# Altium schematic sheet PowerDistribution.SchDoc
size A
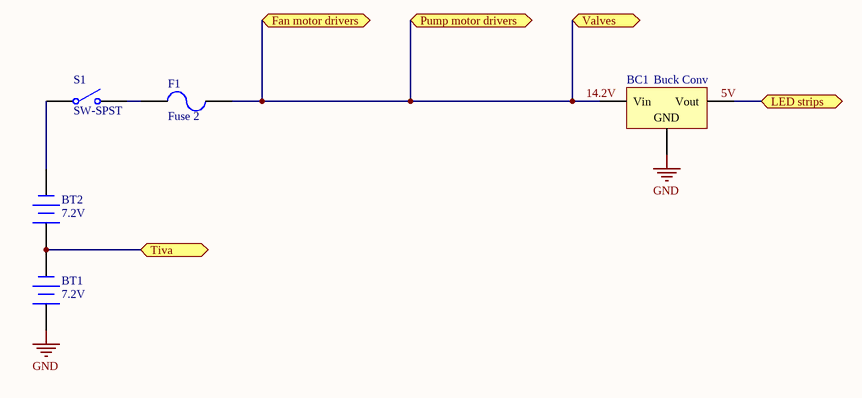
[diagram p0: PowerDistribution.SchDoc]

## Parts
BC1  Buck Conv  [D2PAK_L]
BT1  7.2V  [BAT-2]
BT2  7.2V  [BAT-2]
F1  Fuse 2  [PIN-W2/E2.8]
S1  SW-SPST  [SPST-2]

## Ports
Fan motor drivers (bidir), LED strips (bidir), Pump motor drivers (bidir), Tiva (bidir), Valves (bidir)

## Nets
GND: BC1.2(GND) BT1.1(+)
14.2V: BC1.1(Vin) F1.1 ; port Fan motor drivers, port Pump motor drivers, port Valves
LED strips: BC1.3(Vout) ; port LED strips
Tiva: BT1.2(-) BT2.1(+) ; port Tiva
NetBT2_2: BT2.2(-) S1.1(COMMON)
NetF1_2: F1.2 S1.2(NO)

## Notes on the sheet
- Labels drawn without touching a wire or pin: 5V

## Library data of the parts
BC1 = Volt Reg: Voltage Regulator; Published: 24-Mar-1999; LatestRevisionDate: 29-May-2009; LatestRevisionNote: IPC-7351 Footprint Added.; PackageReference: D2PAK; Publisher: Altium Limited; PackageDescription: 3-Pin Transistor Outline Package 2.54 mm Pitch, 15.1 mm Lead Span
BT1 BT2 = Battery: Multicell Battery; Manufacturer: Generic Components; Published: 1999
F1 = Fuse 2: Fuse; Manufacturer: Generic Components; Class: Passive; Published: 08/06/2000; Publisher: Altium Hobart Technology Centre; SubClass: Fuse
S1 = SW-SPST: Single-Pole, Single-Throw Switch; Manufacturer: Generic Components; Published: 1999